# EAGLE design Button (EAGLE 7.5.0)

## Sheet 1 of 3: CONTROLLER
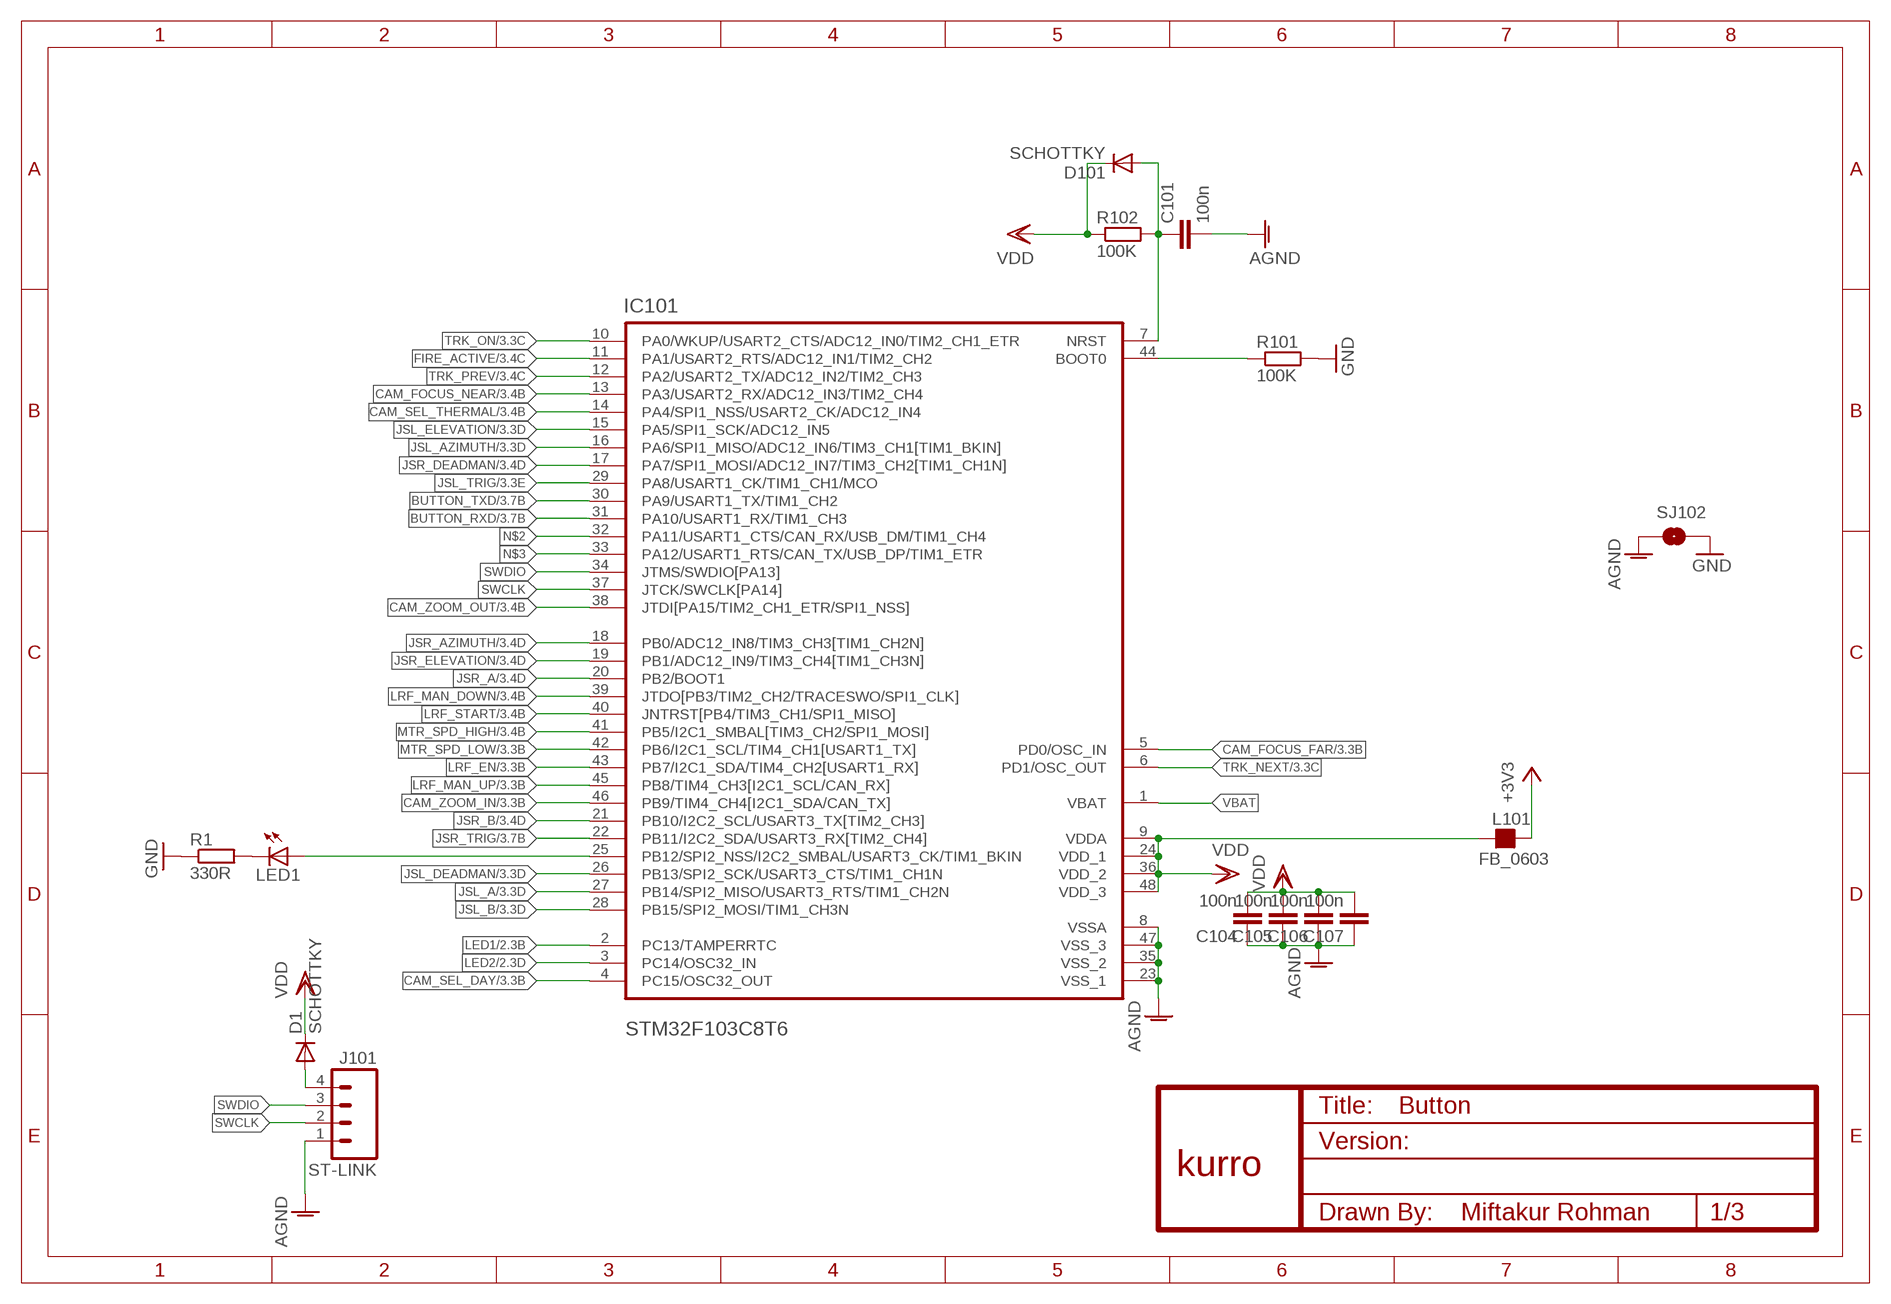
[diagram p0: schematic, sheet 1]

### Parts
C101  100n  C-EUC0603  [C0603]
C104  100n  C-EUC0603  [C0603]
C105  100n  C-EUC0603  [C0603]
C106  100n  C-EUC0603  [C0603]
C107  100n  C-EUC0603  [C0603]
D1  SCHOTTKY  DIODE-MICROMELF-W  [MICROMELF-W]
D101  SCHOTTKY  DIODE-MICROMELF-W  [MICROMELF-W]
IC101  STM32F103C8T6  [QFP50P900X900X160-48N]
J101  ST-LINK  M04-XH-VERT  [XH-4-VERT]
L101  FB_0603  [L0603]
LED1  LED-3MM-NO_SILK  [LED3MM-NS]
R1  330R  R-EU_R0603  [R0603]
R101  100K  R-EU_R0603  [R0603]
R102  100K  R-EU_R0603  [R0603]
SJ102  SOLDERJUMPERTRACE  [SJ_2S-TRACE]
U$1  KURRO_FOOTPRINT  [KURRO-LOGO]

### Nets
+3V3: L101.2 ; also sheet 3
AGND [ic]: C101.2 C104.1 C105.1 C106.1 C107.1 IC101.8(VSSA) IC101.23(VSS_1) IC101.35(VSS_2) IC101.47(VSS_3) J101.1 SJ102.1
BOOT0 [ic]: IC101.44(BOOT0) R101.1
BUTTON_RXD [ic]: IC101.31(PA10/USART1_RX/TIM1_CH3) ; also sheet 3
BUTTON_TXD [ic]: IC101.30(PA9/USART1_TX/TIM1_CH2) ; also sheet 3
CAM_FOCUS_FAR [ic]: IC101.5(PD0/OSC_IN) ; also sheet 3
CAM_FOCUS_NEAR [ic]: IC101.13(PA3/USART2_RX/ADC12_IN3/TIM2_CH4) ; also sheet 3
CAM_SEL_DAY [ic]: IC101.4(PC15/OSC32_OUT) ; also sheet 3
CAM_SEL_THERMAL [ic]: IC101.14(PA4/SPI1_NSS/USART2_CK/ADC12_IN4) ; also sheet 3
CAM_ZOOM_IN [ic]: IC101.46(PB9/TIM4_CH4[I2C1_SDA/CAN_TX]) ; also sheet 3
CAM_ZOOM_OUT [ic]: IC101.38(JTDI[PA15/TIM2_CH1_ETR/SPI1_NSS]) ; also sheet 3
FIRE_ACTIVE [ic]: IC101.11(PA1/USART2_RTS/ADC12_IN1/TIM2_CH2) ; also sheet 3
GND: R1.1 R101.2 SJ102.2 ; also sheet 2,3
JSL_A [ic]: IC101.27(PB14/SPI2_MISO/USART3_RTS/TIM1_CH2N) ; also sheet 3
JSL_AZIMUTH [ic]: IC101.16(PA6/SPI1_MISO/ADC12_IN6/TIM3_CH1[TIM1_BKIN]) ; also sheet 3
JSL_B [ic]: IC101.28(PB15/SPI2_MOSI/TIM1_CH3N) ; also sheet 3
JSL_DEADMAN [ic]: IC101.26(PB13/SPI2_SCK/USART3_CTS/TIM1_CH1N) ; also sheet 3
JSL_ELEVATION [ic]: IC101.15(PA5/SPI1_SCK/ADC12_IN5) ; also sheet 3
JSL_TRIG [ic]: IC101.29(PA8/USART1_CK/TIM1_CH1/MCO) ; also sheet 3
JSR_A [ic]: IC101.20(PB2/BOOT1) ; also sheet 3
JSR_AZIMUTH [ic]: IC101.18(PB0/ADC12_IN8/TIM3_CH3[TIM1_CH2N]) ; also sheet 3
JSR_B [ic]: IC101.21(PB10/I2C2_SCL/USART3_TX[TIM2_CH3]) ; also sheet 3
JSR_DEADMAN [ic]: IC101.17(PA7/SPI1_MOSI/ADC12_IN7/TIM3_CH2[TIM1_CH1N]) ; also sheet 3
JSR_ELEVATION [ic]: IC101.19(PB1/ADC12_IN9/TIM3_CH4[TIM1_CH3N]) ; also sheet 3
JSR_TRIG [ic]: IC101.22(PB11/I2C2_SDA/USART3_RX[TIM2_CH4]) ; also sheet 3
LED1 [ic]: IC101.2(PC13/TAMPERRTC) ; also sheet 2
LED2 [ic]: IC101.3(PC14/OSC32_IN) ; also sheet 2
LRF_EN [ic]: IC101.43(PB7/I2C1_SDA/TIM4_CH2[USART1_RX]) ; also sheet 3
LRF_MAN_DOWN [ic]: IC101.39(JTDO[PB3/TIM2_CH2/TRACESWO/SPI1_CLK]) ; also sheet 3
LRF_MAN_UP [ic]: IC101.45(PB8/TIM4_CH3[I2C1_SCL/CAN_RX]) ; also sheet 3
LRF_START [ic]: IC101.40(JNTRST[PB4/TIM3_CH1/SPI1_MISO]) ; also sheet 3
MTR_SPD_HIGH [ic]: IC101.41(PB5/I2C1_SMBAL[TIM3_CH2/SPI1_MOSI]) ; also sheet 3
MTR_SPD_LOW [ic]: IC101.42(PB6/I2C1_SCL/TIM4_CH1[USART1_TX]) ; also sheet 3
N$1 [ic]: IC101.25(PB12/SPI2_NSS/I2C2_SMBAL/USART3_CK/TIM1_BKIN) LED1.A
N$2 [ic]: IC101.32(PA11/USART1_CTS/CAN_RX/USB_DM/TIM1_CH4)
N$3 [ic]: IC101.33(PA12/USART1_RTS/CAN_TX/USB_DP/TIM1_ETR)
N$6: D1.A J101.4
N$7 [ic]: LED1.K(C) R1.2
RST [ic]: C101.1 D101.A IC101.7(NRST) R102.2
SWCLK [ic]: IC101.37(JTCK/SWCLK[PA14]) J101.2
SWDIO [ic]: IC101.34(JTMS/SWDIO[PA13]) J101.3
TRK_NEXT [ic]: IC101.6(PD1/OSC_OUT) ; also sheet 3
TRK_ON [ic]: IC101.10(PA0/WKUP/USART2_CTS/ADC12_IN0/TIM2_CH1_ETR) ; also sheet 3
TRK_PREV [ic]: IC101.12(PA2/USART2_TX/ADC12_IN2/TIM2_CH3) ; also sheet 3
VBAT [ic]: IC101.1(VBAT)
VDD [ic]: C104.2 C105.2 C106.2 C107.2 D1.C D101.C IC101.9(VDDA) IC101.24(VDD_1) IC101.36(VDD_2) IC101.48(VDD_3) L101.1 R102.1

## Sheet 2 of 3
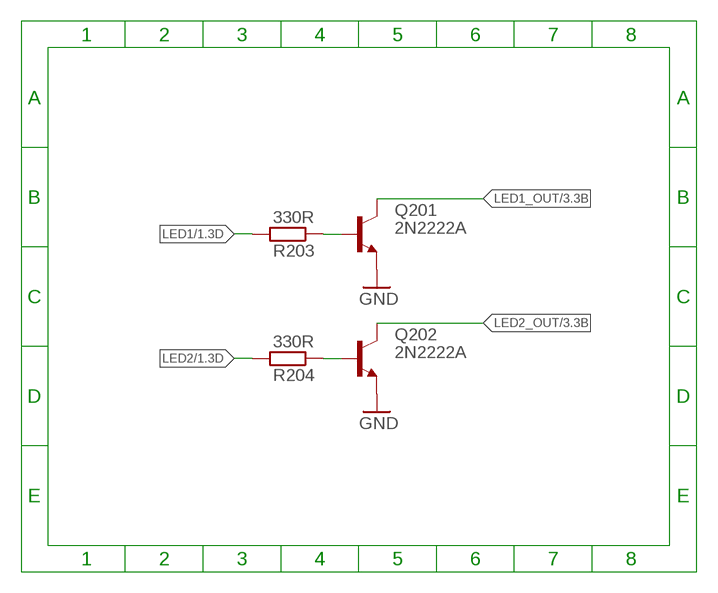
[diagram p1: schematic, sheet 2]

### Parts
Q201  2N2222A  2N2222A-REFLOW  [SOT23]
Q202  2N2222A  2N2222A-REFLOW  [SOT23]
R203  330R  R-EU_R0603  [R0603]
R204  330R  R-EU_R0603  [R0603]

### Nets
GND: Q201.2(E) Q202.2(E) ; also sheet 1,3
LED1 [ic]: R203.2 ; also sheet 1
LED1_OUT: Q201.3(C) ; also sheet 3
LED2 [ic]: R204.2 ; also sheet 1
LED2_OUT: Q202.3(C) ; also sheet 3
N$34 [ic]: Q201.1(B) R203.1
N$37 [ic]: Q202.1(B) R204.1

## Sheet 3 of 3: CONNECTOR
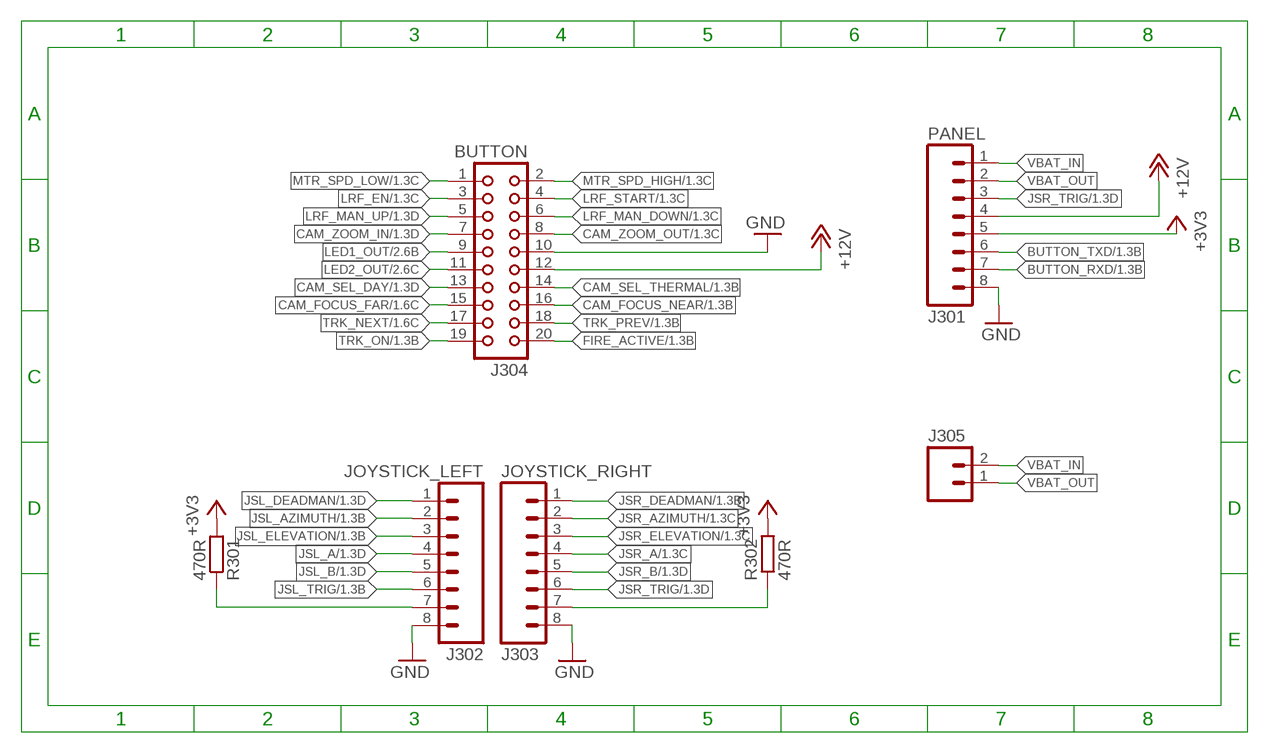
[diagram p2: schematic, sheet 3]

### Parts
J301  PANEL  M08-XH-RA  [XH-8-RA]
J302  JOYSTICK_LEFT  M08-XH-RA  [XH-8-RA]
J303  JOYSTICK_RIGHT  M08-XH-RA  [XH-8-RA]
J304  BUTTON  CON20  [CON20]
J305  M02-XH-RA  [XH-2-RA]
R301  470R  R-EU_R0603  [R0603]
R302  470R  R-EU_R0603  [R0603]

### Nets
+3V3: J301.5 R301.2 R302.2 ; also sheet 1
+12V [ic]: J301.4 J304.12
BUTTON_RXD [ic]: J301.7 ; also sheet 1
BUTTON_TXD [ic]: J301.6 ; also sheet 1
CAM_FOCUS_FAR [ic]: J304.15 ; also sheet 1
CAM_FOCUS_NEAR [ic]: J304.16 ; also sheet 1
CAM_SEL_DAY [ic]: J304.13 ; also sheet 1
CAM_SEL_THERMAL [ic]: J304.14 ; also sheet 1
CAM_ZOOM_IN [ic]: J304.7 ; also sheet 1
CAM_ZOOM_OUT [ic]: J304.8 ; also sheet 1
FIRE_ACTIVE [ic]: J304.20 ; also sheet 1
GND: J301.8 J302.8 J303.8 J304.10 ; also sheet 1,2
JSL_A [ic]: J302.4 ; also sheet 1
JSL_AZIMUTH [ic]: J302.2 ; also sheet 1
JSL_B [ic]: J302.5 ; also sheet 1
JSL_DEADMAN [ic]: J302.1 ; also sheet 1
JSL_ELEVATION [ic]: J302.3 ; also sheet 1
JSL_TRIG [ic]: J302.6 ; also sheet 1
JSR_A [ic]: J303.4 ; also sheet 1
JSR_AZIMUTH [ic]: J303.2 ; also sheet 1
JSR_B [ic]: J303.5 ; also sheet 1
JSR_DEADMAN [ic]: J303.1 ; also sheet 1
JSR_ELEVATION [ic]: J303.3 ; also sheet 1
JSR_TRIG [ic]: J301.3 J303.6 ; also sheet 1
LED1_OUT: J304.9 ; also sheet 2
LED2_OUT: J304.11 ; also sheet 2
LRF_EN [ic]: J304.3 ; also sheet 1
LRF_MAN_DOWN [ic]: J304.6 ; also sheet 1
LRF_MAN_UP [ic]: J304.5 ; also sheet 1
LRF_START [ic]: J304.4 ; also sheet 1
MTR_SPD_HIGH [ic]: J304.2 ; also sheet 1
MTR_SPD_LOW [ic]: J304.1 ; also sheet 1
N$4: J303.7 R302.1
N$5: J302.7 R301.1
TRK_NEXT [ic]: J304.17 ; also sheet 1
TRK_ON [ic]: J304.19 ; also sheet 1
TRK_PREV [ic]: J304.18 ; also sheet 1
VBAT_IN: J301.1 J305.2
VBAT_OUT: J301.2 J305.1

## Library data of the parts
C101 C104-C107 = resistor:C-EU: CAPACITOR, European symbol
D1 D101 = diode:DIODE-: DIODE
IC101 = ST Microelctronics_By_element14_Batch_1:STM32F103C8T6: Medium-density performance line ARM-based 32-bit MCU; LINK: https://www.tokopedia.com/embedded-world/stm32-stm32f103c8t6-lqfp48-arm-based-microcontroller-mcu-lqfp-48-au02; MPN: STM32F103CBT6; OC_FARNELL: 1606327; OC_NEWARK: 11N8296; PACKAGE: QFP-48; SUPPLIER: STMICROELECTRONICS
J101 = SparkFun-Connectors:M04: Header 4 Standard 4-pin 0.1" header. Use with straight break away headers (SKU : PRT-00116), right angle break away headers (PRT-00553), swiss pins (PRT-00743), machine pins (PRT-00117), and female headers (PRT-00115). Molex polarized connector foot print use with SKU : PRT-08231 with associated crimp pins and housings. 1MM SMD Version SKU: PRT-10208
J301-J303 = SparkFun-Connectors:M08: Header 8 Standard 8-pin 0.1" header. Use with straight break away headers (SKU : PRT-00116), right angle break away headers (PRT-00553), swiss pins (PRT-00743), machine pins (PRT-00117), and female headers (PRT-00115).
J304 = con-harting:CON20: CONNECTOR
J305 = SparkFun-Connectors:M02: Standard 2-pin 0.1" header. Use with - straight break away headers ( PRT-00116) - right angle break away headers (PRT-00553) - swiss pins (PRT-00743) - machine pins (PRT-00117) - female headers (PRT-00115) Molex polarized connector foot print use with: PRT-08233 with associated crimp pins and housings. 2.54_SCREWTERM for use with PRT-10571. 3.5mm Screw Terminal footprints for PRT-08084 5mm Screw Terminal footprints for use with PRT-08433
L101 = rc-master:FB_: FERRITE BEAD
LED1 = SparkFun-LED:LED: LEDs Standard schematic elements and footprints for 5mm, 3mm, 1206, and 0603 sized LEDs. 5mm - Spark Fun Electronics SKU : COM-00529 (and others)
Q201 Q202 = scorpion:2N2222*
R1 R101 R102 = resistor:R-EU_: RESISTOR, European symbol
R203 R204 R301 R302 = rcl:R-EU_: RESISTOR, European symbol
SJ102 = SparkFun:SOLDERJUMPER: Solder Jumper Standard SMD solder jumper. Used to automate production. Two varients : Normally Open and Normally Closed are the same, but have different paste layers. NC will have a large amount of paste and should jumper during reflow.
U$1 = SparkFun:KURRO_FOOTPRINT

## Net classes
0 default: width 0.406 mm, drill 0.59 mm, clearance 0.305 mm
1 ic: width 0.254 mm, drill 0.59 mm, clearance 0.203 mm

## Board
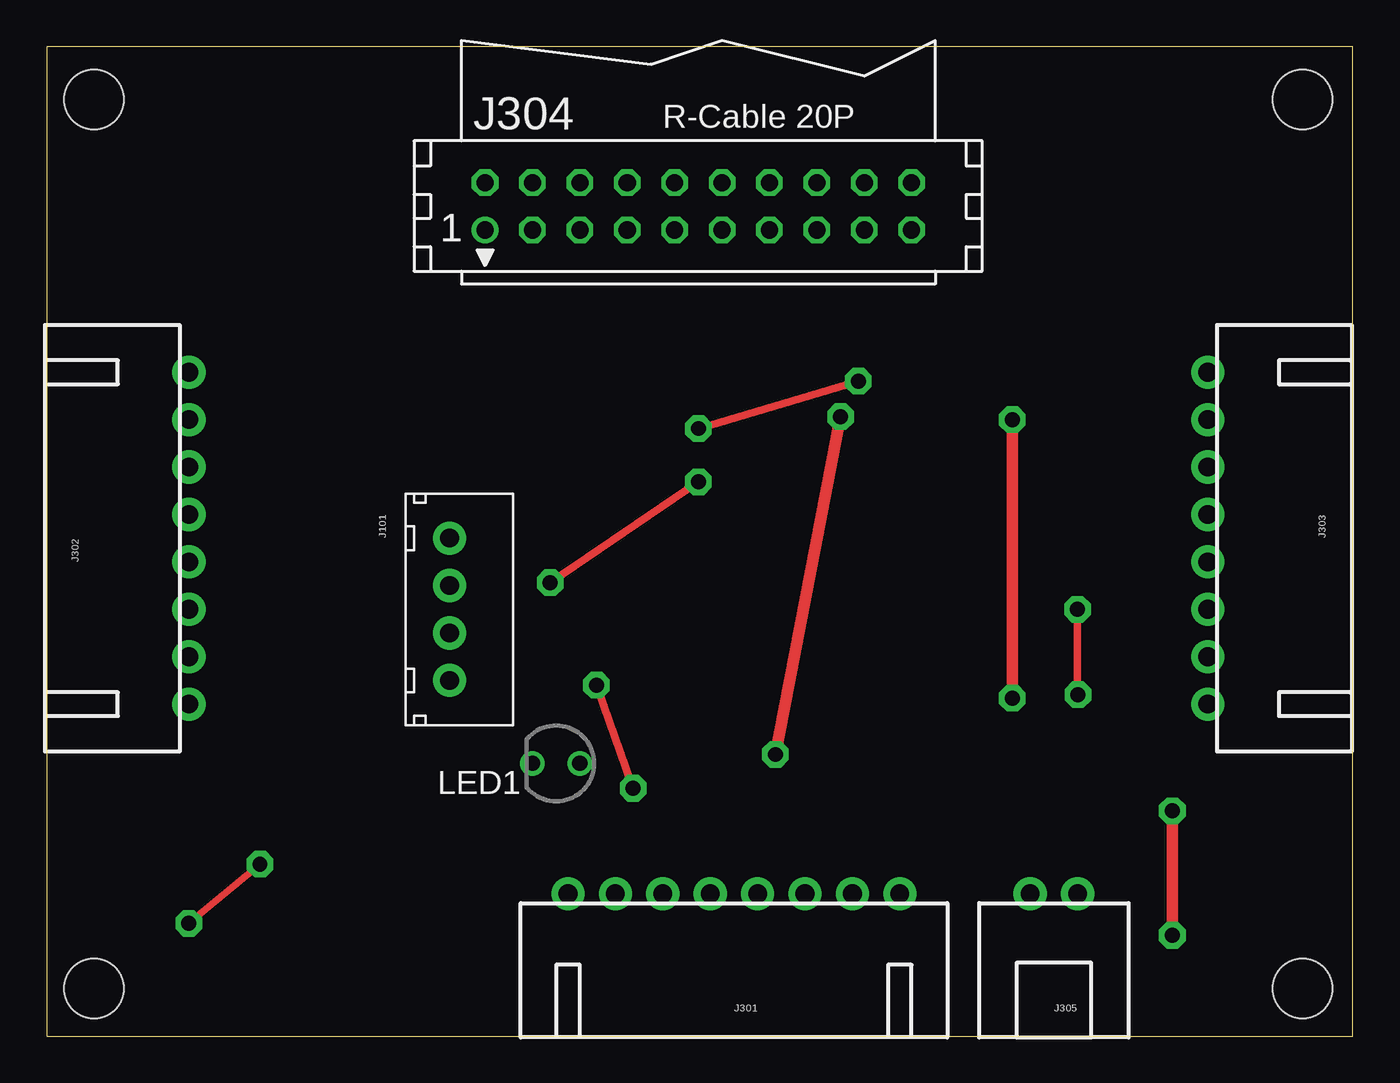
[diagram p3: board, top side]
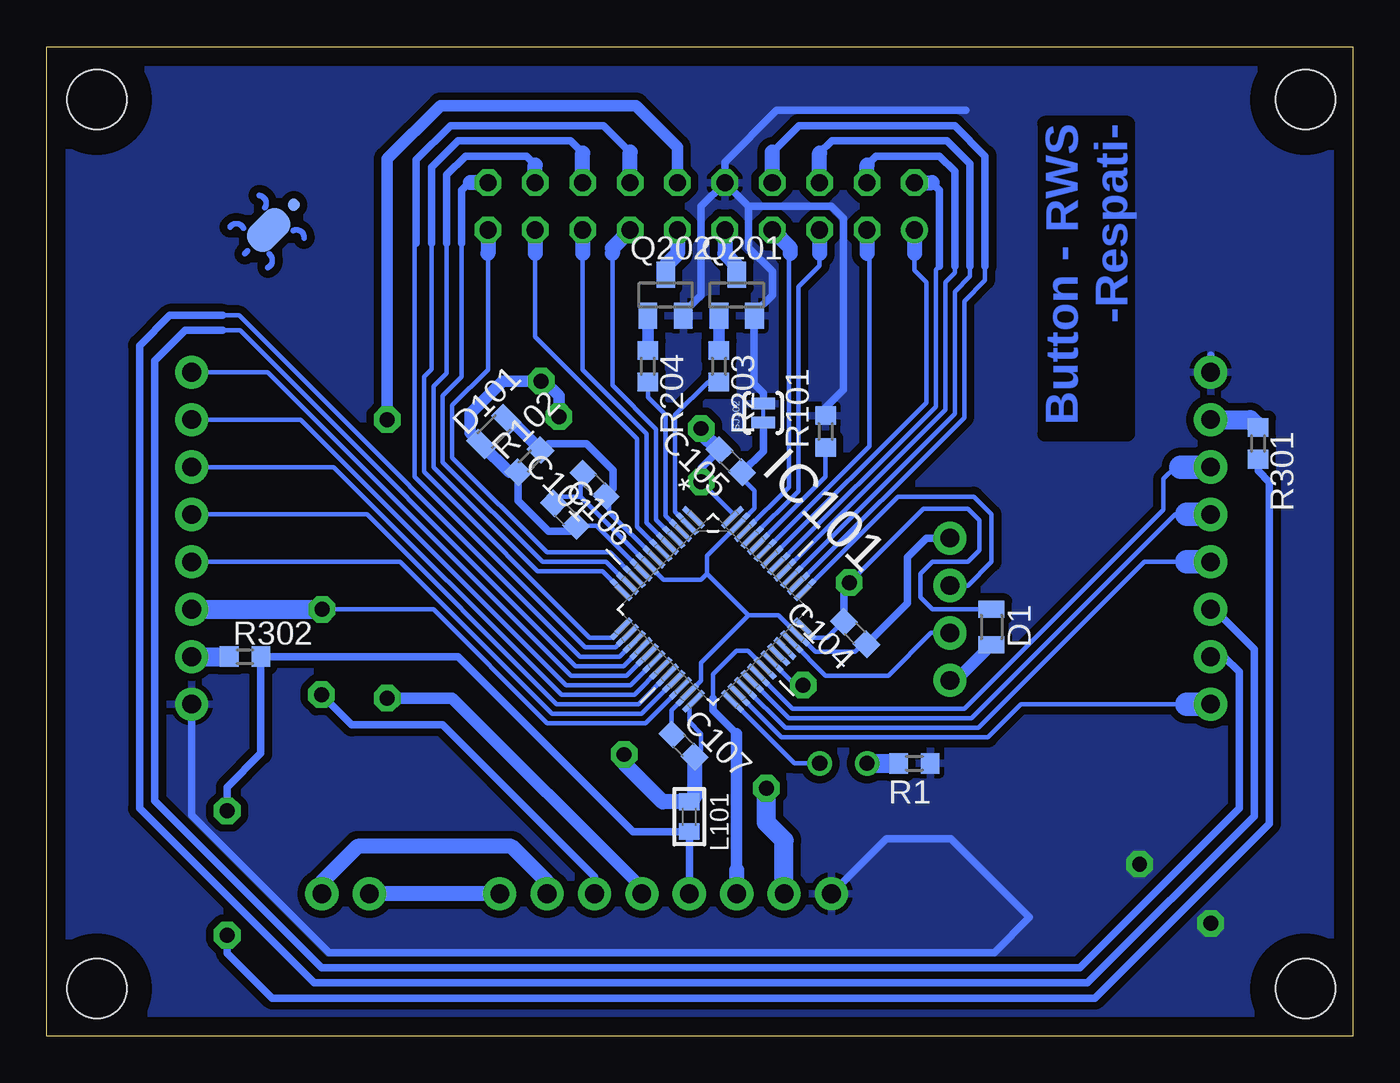
[diagram p4: board, bottom side, seen from below]

Size 70 x 53 mm. Coordinates in mm from the lower left corner, seen from the top.
Outline: 0,0 70,0 70,53 0,53 0,0
Copper layers (1*16): Top 0.035mm / dielectric 1.5mm / Bottom 0.035mm
Design rules "default": minimum track width 10mil, minimum drill 24mil, track to track 8mil, track to pad 8mil, pad to pad 8mil, via to via 8mil, smd to smd 8mil, copper to edge 40mil, drill to drill 8mil, minimum pad ring 10mil, minimum via ring 8mil, stop-mask expansion 4mil, vias tented up to drill 0mil, thermal gap 10mil
Holes 3.2 mm at 2.54,2.54 67.31,2.54 67.31,50.16 2.54,50.16
bRestrict: area 0,47.6 to 5.1,52.7; area 64.8,47.6 to 69.9,52.7; area 64.8,0 to 69.9,5.1; area 0,0 to 5.1,5.1

### Footprints (pad centres in the part's own frame; a part is rotated, then mirrored left to right if it is on the bottom)
C0603 = smd 1.1 x 1: 1 -0.85,0; 2 0.85,0
MICROMELF-W = smd 0.9 x 1.4: A 0.95,0; C -0.95,0
QFP50P900X900X160-48N = smd 1.473 x 0.279: 1 -4.216,2.743; 2 -4.216,2.261; 3 -4.216,1.753; 4 -4.216,1.245; 5 -4.216,0.762; 6 -4.216,0.254; 7 -4.216,-0.254; 8 -4.216,-0.762; 9 -4.216,-1.245; 10 -4.216,-1.753; 11 -4.216,-2.261; 12 -4.216,-2.743; 25 4.216,-2.743; 26 4.216,-2.261; 27 4.216,-1.753; 28 4.216,-1.245; 29 4.216,-0.762; 30 4.216,-0.254; 31 4.216,0.254; 32 4.216,0.762; 33 4.216,1.245; 34 4.216,1.753; 35 4.216,2.261; 36 4.216,2.743 | smd 0.279 x 1.473: 13 -2.743,-4.216; 14 -2.261,-4.216; 15 -1.753,-4.216; 16 -1.245,-4.216; 17 -0.762,-4.216; 18 -0.254,-4.216; 19 0.254,-4.216; 20 0.762,-4.216; 21 1.245,-4.216; 22 1.753,-4.216; 23 2.261,-4.216; 24 2.743,-4.216; 37 2.743,4.216; 38 2.261,4.216; 39 1.753,4.216; 40 1.245,4.216; 41 0.762,4.216; 42 0.254,4.216; 43 -0.254,4.216; 44 -0.762,4.216; 45 -1.245,4.216; 46 -1.753,4.216; 47 -2.261,4.216; 48 -2.743,4.216
XH-4-VERT = drill 1 pad 1.778: 1 -3.81,0; 2 -1.27,0; 3 1.27,0; 4 3.81,0
XH-8-RA = drill 1 pad 1.778: 1 -8.89,0; 2 -6.35,0; 3 -3.81,0; 4 -1.27,0; 5 1.27,0; 6 3.81,0; 7 6.35,0; 8 8.89,0
CON20 = drill 0.914: 1 -11.43,-1.27 | drill 0.914 octagon: 2 -11.43,1.27; 3 -8.89,-1.27; 4 -8.89,1.27; 5 -6.35,-1.27; 6 -6.35,1.27; 7 -3.81,-1.27; 8 -3.81,1.27; 9 -1.27,-1.27; 10 -1.27,1.27; 11 1.27,-1.27; 12 1.27,1.27; 13 3.81,-1.27; 14 3.81,1.27; 15 6.35,-1.27; 16 6.35,1.27; 17 8.89,-1.27; 18 8.89,1.27; 19 11.43,-1.27; 20 11.43,1.27
XH-2-RA = drill 1 pad 1.778: 1 -1.27,0; 2 1.27,0
L0603 = smd 0.9 x 1.1: 1 -0.794,0; 2 0.794,0
LED3MM-NS = drill 0.813: A -1.27,0; K 1.27,0
SOT23 = smd 1 x 1.4: 1 -0.95,-1.1; 2 0.95,-1.1; 3 0,1.1
R0603 = smd 1 x 1.1: 1 -0.85,0; 2 0.85,0
SJ_2S-TRACE = smd 0.635 x 1.27: 1 -0.508,0; 2 0.508,0
KURRO-LOGO = smd 2.54 x 1.651 rotated 45 bottom: P$1 0,0 | smd 0.635 x 0.635 rotated 45 bottom: P$2 1.347,1.347

### Placement (x,y rotation side)
C101  40.64,29.53 135 bottom
C104  26.67,21.59 135 bottom
C105  33.34,30.8 135 bottom
C106  42.23,27.94 315 bottom
C107  35.88,15.56 315 bottom
D1  19.37,21.91 270 bottom
D101  46.04,32.38 45 bottom
IC101  34.29,22.86 315 bottom
J101  21.59,22.86 270 top
J301  36.83,7.62 180 top
J302  7.62,26.67 90 top
J303  62.23,26.67 270 top
J304  34.92,44.45 0 top
J305  53.98,7.62 180 top
L101  35.56,11.75 270 bottom
LED1  27.3,14.61 180 top
Q201  33.02,39.69 0 bottom
Q202  36.83,39.69 0 bottom
R1  23.5,14.61 180 bottom
R101  28.26,32.38 90 bottom
R102  44.13,30.8 45 bottom
R203  33.97,35.88 270 bottom
R204  37.78,35.88 270 bottom
R301  5.08,31.75 270 bottom
R302  59.37,20.32 0 bottom
SJ102  31.6,33.38 90 bottom
U$1  58.1,43.18 90 top

### Tracks (layer width: path | path; a pad name or v marks a point on that pad's centre or on a via)
+3V3  (via drill 0.8 pad 1.42)
  Top 0.61: v60.33,12.06 v60.33,5.4
  Bottom 0.406: J301.5 L101.2 38.58,10.95 47.94,20.32 R302.2 58.52,15.14 60.33,13.34 v60.33,12.06 | R301.2 5.08,30.28 4.47,29.67 4.47,11.38 13.82,2.03 57.91,2.03 60.33,4.45 v60.33,5.4
+12V  (via drill 0.8 pad 1.42)
  Top 0.61: v51.75,33.02 v51.75,18.1
  Bottom 0.61: J304.12 36.2,47.62 38.42,49.85 48.9,49.85 51.75,46.99 v51.75,33.02 | J301.4 38.1,7.94 48.26,18.1 v51.75,18.1
AGND
  Bottom 0.254: 41.39,28.88 IC101.8 36.95,24.45 34.92,24.45 34.61,24.77 | 41.39,28.88 42.49,28.88 C106.1 | C101.2 41.39,29.98 41.39,28.88 | C107.1 36.51,16.19 36.51,17.44 IC101.23 34.92,19.03 34.92,20 32.38,22.54 | C104.1 26.25,20.99 26.67,20.57 28.81,20.57 IC101.35 30.78,22.54 32.38,22.54 | C105.1 32.74,29.88 32.07,29.21 32.07,28.28 IC101.47 34.61,25.74 34.61,24.77 | 34.61,24.77 32.38,22.54
  Bottom 0.406: C104.1 23.88,23.18 23.88,25.65 22.86,26.67 J101.1 | SJ102.1 31.6,31.34 C105.1
BOOT0
  Bottom 0.254: IC101.44 28.26,29.97 R101.1
BUTTON_RXD  (via drill 0.8 pad 1.42)
  Top 0.406: v31.43,13.27 v29.46,18.8
  Bottom 0.254: IC101.31 29.87,18.8 v29.46,18.8
  Bottom 1.016: J301.7 30.48,10.48 31.43,11.43 v31.43,13.27
BUTTON_TXD
  Bottom 0.254: IC101.30 32.43,20.64 33.02,20.64 34.29,19.37 34.29,18.1
  Bottom 0.406: 34.29,18.1 34.29,17.46 33.02,16.19
  Bottom 0.61: 33.02,8.89 33.02,16.19
  Bottom 0.813: 33.02,8.89 J301.6
CAM_FOCUS_FAR
  Bottom 0.254: IC101.5 37.85,27.49 37.85,32.26 41.27,35.69 41.27,41.91
  Bottom 0.813: J304.15 41.27,41.91
CAM_FOCUS_NEAR
  Bottom 0.254: IC101.13 39.69,21.34 40.89,21.34 49.78,30.23 49.78,35.31 49.38,35.71 49.38,42.47
  Bottom 0.406: 49.38,42.47 49.38,46.53 47.95,47.95 41.92,47.95 41.27,47.31
  Bottom 0.813: J304.16 41.27,47.31
CAM_SEL_DAY
  Bottom 0.254: IC101.4 37.34,27.67 37.34,32.51 39.69,34.86 39.69,41.91
  Bottom 0.813: J304.13 39.69,42.23 39.69,41.91
CAM_SEL_THERMAL
  Bottom 0.254: IC101.14 39.52,20.83 41.15,20.83 50.29,29.97 50.29,42.37 50.19,42.47
  Bottom 0.406: 50.19,42.47 50.19,46.94 48.36,48.77 40.16,48.77 38.73,47.35
  Bottom 0.813: J304.14 38.73,47.35
CAM_ZOOM_IN
  Bottom 0.254: IC101.46 30.23,29.4 30.23,41.85 30.16,41.91
  Bottom 0.813: J304.7 30.16,42.23 30.16,41.91
CAM_ZOOM_OUT
  Bottom 0.254: IC101.38 20.83,33.12 20.83,39.37 19.71,40.49 19.71,41.25
  Bottom 0.406: 19.71,41.25 19.71,47.14 21.34,48.77 29.69,48.77 31.11,47.35
  Bottom 0.813: J304.8 31.11,47.35
FIRE_ACTIVE
  Bottom 0.254: IC101.11 40.03,25.4 43.43,25.4 48.77,30.73 48.77,34.29 47.75,35.31 47.75,42.47
  Bottom 0.406: 47.31,45.72 47.35,45.72 47.75,45.31 47.75,42.47
  Bottom 0.813: J304.20 47.31,45.72
GND  (via drill 0.8 pad 1.42)
  Top 0.406: v7.62,6.03 v11.43,9.21
  Bottom 0.406: 32.38,44.45 32.38,42.23 31.11,40.96 31.11,39.69 32.07,38.73 Q201.2 32.11,38.55 32.11,34.95 31.6,34.44 SJ102.2 | 32.38,44.45 J304.10 | Q202.2 35.88,38.73 34.92,39.69 34.92,44.45 J304.10 | R101.2 28.26,33.66 27.3,34.61 27.3,43.81 27.94,44.45 32.38,44.45 | J301.8 24.99,10.57 21.54,10.57 17.32,6.35 19.2,4.47 54.86,4.47 62.23,11.84 J303.8 | J302.8 7.62,36.47 | 20.73,49.58 30.89,49.58 33.66,46.81 J304.10
  pour Bottom (isolate 0.406, rank 6): 0,0 70.17,0 70.17,53.02 0,53.02
JSL_A
  Bottom 0.254: IC101.27 30.42,16.51 20.07,16.51 11.18,25.4 8.89,25.4
  Bottom 1.27: J302.4 8.89,25.4
JSL_AZIMUTH
  Bottom 0.254: IC101.16 39.1,19.81 41.66,19.81 59.64,37.8 60.55,37.8
  Bottom 0.406: 60.55,37.8 62.59,37.8 64.21,36.17 64.21,12.6 55.27,3.66 14.63,3.66 6.1,12.19 6.1,19.51 6.91,20.32 J302.2
JSL_B
  Bottom 0.254: IC101.28 30.21,17.02 20.45,17.02 9.53,27.94 8.89,27.94
  Bottom 1.27: J302.5 8.89,27.94
JSL_DEADMAN
  Bottom 0.254: IC101.26 30.63,16 19.56,16 17.78,17.78 8.89,17.78
  Bottom 1.27: J302.1 8.89,17.78
JSL_ELEVATION
  Bottom 0.254: IC101.15 39.31,20.32 41.4,20.32 59.69,38.61 60.55,38.61
  Bottom 0.406: 60.55,38.61 63.4,38.61 65.02,36.98 65.02,12.19 55.68,2.85 14.22,2.85 5.28,11.79 5.28,20.73 7.42,22.86 J302.3
JSL_TRIG
  Bottom 0.254: IC101.29 30.03,17.53 20.83,17.53 10.16,28.19 10.16,29.84 9.53,30.48 9.21,30.48
  Bottom 1.27: J302.6 9.21,30.48
JSR_A
  Bottom 0.254: IC101.20 38.29,17.78 42.67,17.78 52.83,27.94 J303.4
JSR_AZIMUTH
  Bottom 0.254: IC101.18 38.71,18.8 42.16,18.8 56.39,33.02 J303.2
JSR_B
  Bottom 0.254: IC101.21 38.12,17.27 42.93,17.27 51.05,25.4 J303.5
JSR_DEADMAN
  Bottom 0.254: IC101.17 38.92,19.3 41.91,19.3 58.17,35.56 J303.1
JSR_ELEVATION
  Bottom 0.254: IC101.19 38.5,18.29 42.42,18.29 54.61,30.48 J303.3
JSR_TRIG  (via drill 0.8 pad 1.42)
  Top 0.406: v55.24,22.86 55.24,18.31 v55.27,18.29
  Bottom 0.254: IC101.22 37.91,16.76 43.18,16.76 49.28,22.86 v55.24,22.86
  Bottom 0.406: J301.3 40.64,8.53 48.77,16.66 53.65,16.66 v55.27,18.29
  Bottom 1.016: J303.6 v55.24,22.86
LED1
  Bottom 0.254: IC101.2 36.32,28.09 36.32,33.27 34.57,35.03 R203.2
LED1_OUT
  Bottom 0.813: J304.9 33.66,41.91 33.02,41.27 Q201.3
LED2
  Bottom 0.254: IC101.3 36.83,27.88 36.83,33.27 37.78,34.23 R204.2
LED2_OUT
  Bottom 0.813: J304.11 36.2,41.91 36.83,41.27 Q202.3
LRF_EN
  Bottom 0.254: IC101.43 25.91,31.6 25.91,41.78 26.04,41.91
  Bottom 0.813: J304.3 26.04,41.91
LRF_MAN_DOWN
  Bottom 0.254: IC101.39 21.34,33.34 21.34,39.88 20.52,40.69 20.52,41.25
  Bottom 0.406: 28.57,47.31 27.93,47.95 21.74,47.95 20.52,46.74 20.52,41.25
  Bottom 0.813: J304.6 28.57,47.31
LRF_MAN_UP
  Bottom 0.254: IC101.45 29.72,29.19 29.72,40.13 28.57,41.27 28.57,41.91
  Bottom 0.813: J304.5 28.57,41.91
LRF_START
  Bottom 0.254: IC101.40 21.84,33.55 21.84,40.39 21.34,40.89 21.34,41.25
  Bottom 0.406: 26.04,46.67 25.57,47.14 22.15,47.14 21.34,46.33 21.34,41.25
  Bottom 0.813: J304.4 26.04,46.67
MTR_SPD_HIGH
  Bottom 0.254: IC101.41 22.35,33.72 22.35,41.05 22.15,41.25
  Bottom 0.406: 22.55,45.72 22.15,45.31 22.15,41.25
  Bottom 0.813: J304.2 22.55,45.72
MTR_SPD_LOW
  Bottom 0.254: IC101.42 22.86,33.93 22.86,40.39 23.5,41.02 23.5,41.91
  Bottom 0.813: J304.1 23.5,41.91
N$1
  Bottom 0.254: LED1.A 29.91,14.61 IC101.25
N$4
  Bottom 1.016: J303.7 R302.1
N$5
  Bottom 1.016: J302.7 5.5,33.02 R301.1
N$6
  Bottom 0.61: J101.4 21.27,19.05 D1.A
N$7
  Bottom 1.016: LED1.K R1.2
N$34
  Bottom 0.61: R203.1 Q201.1
N$37
  Bottom 0.61: R204.1 Q202.1
RST
  Bottom 0.254: IC101.7 39.85,28.06 39.85,28.74 C101.1
  Bottom 0.406: C101.1 39.65,29.32 39.65,30.3 41.07,31.73 43.1,31.73 43.43,31.4 R102.2
  Bottom 0.61: D101.A 45.19,33.06 R102.2
SWCLK
  Bottom 0.254: IC101.37 24.38,28.89 20.32,28.89 19.37,27.94 19.37,25.4 20.64,24.13 J101.2
SWDIO
  Bottom 0.254: IC101.34 28.25,19.3 24.89,19.3 22.61,21.59 J101.3
TRK_NEXT
  Bottom 0.254: IC101.6 38.35,27.28 38.35,32 43.81,37.47 43.81,41.91
  Bottom 0.813: J304.17 43.81,41.91
TRK_ON
  Bottom 0.254: IC101.10 39.82,25.91 43.18,25.91 48.26,30.99 48.26,33.78 46.35,35.69 46.35,41.91
  Bottom 0.813: J304.19 46.35,41.91
TRK_PREV
  Bottom 0.254: IC101.12 40.2,24.89 43.69,24.89 49.28,30.48 49.28,34.8 48.56,35.51 48.56,42.47
  Bottom 0.406: 48.56,42.47 48.56,46.13 47.55,47.14 44.28,47.14 43.81,46.67
  Bottom 0.813: J304.18 43.81,46.67
VBAT_IN
  Bottom 0.813: J301.1 J305.2
VBAT_OUT
  Bottom 0.813: J301.2 43.18,8.26 45.09,10.16 53.34,10.16 55.24,8.26 J305.1
VDD  (via drill 0.8 pad 1.42)
  Top 0.406: v34.92,32.54 v43.5,35.08 | v26.99,24.29 v34.92,29.69
  Top 0.61: v42.55,33.18 v39.05,15.08
  Bottom 0.254: IC101.9 40.53,27.34 C106.2 | C107.2 34.92,15.31 34.92,16.19 35.56,16.83 35.56,17.71 IC101.24 | IC101.36 28.89,21.34 28.19,21.34 27.34,22.19 C104.2 | 34.01,31.4 C105.2 | D1.C 22.54,22.86 23.18,23.5 23.18,24.77 22.54,25.4 20.64,25.4 20,26.04 20,27.62 20.64,28.26 23.02,28.26 v26.99,24.29 | IC101.48 33.25,28.01 v34.92,29.69
  Bottom 0.406: C106.2 41.91,27.05 43.1,27.05 44.73,28.68 R102.1 | C104.2 27.27,24 v26.99,24.29 | v34.92,29.69 34.92,30.41 C105.2
  Bottom 0.61: R102.1 45.19,30.2 D101.C 47.31,32.31 47.31,33.34 45.56,35.08 v43.5,35.08 43.34,35.08 42.55,34.29 v42.55,33.18 | v39.05,15.08 39.05,14.61
  Bottom 0.813: C107.2 35.28,12.82 L101.1 36.99,12.54 39.05,14.61 | 34.01,31.4 34.92,32.32 v34.92,32.54

### Text on the board
Bottom: Button - RWS / -Respati-